# EasyEDA schematic SCH_ChristmasDecoration.json
TITLE: ChristmasBall; REV: 1.1; Date: 2023-12-10; Sheet: 1/1; Drawn By: ArseniiTym; Company: AquaPilot Inc.
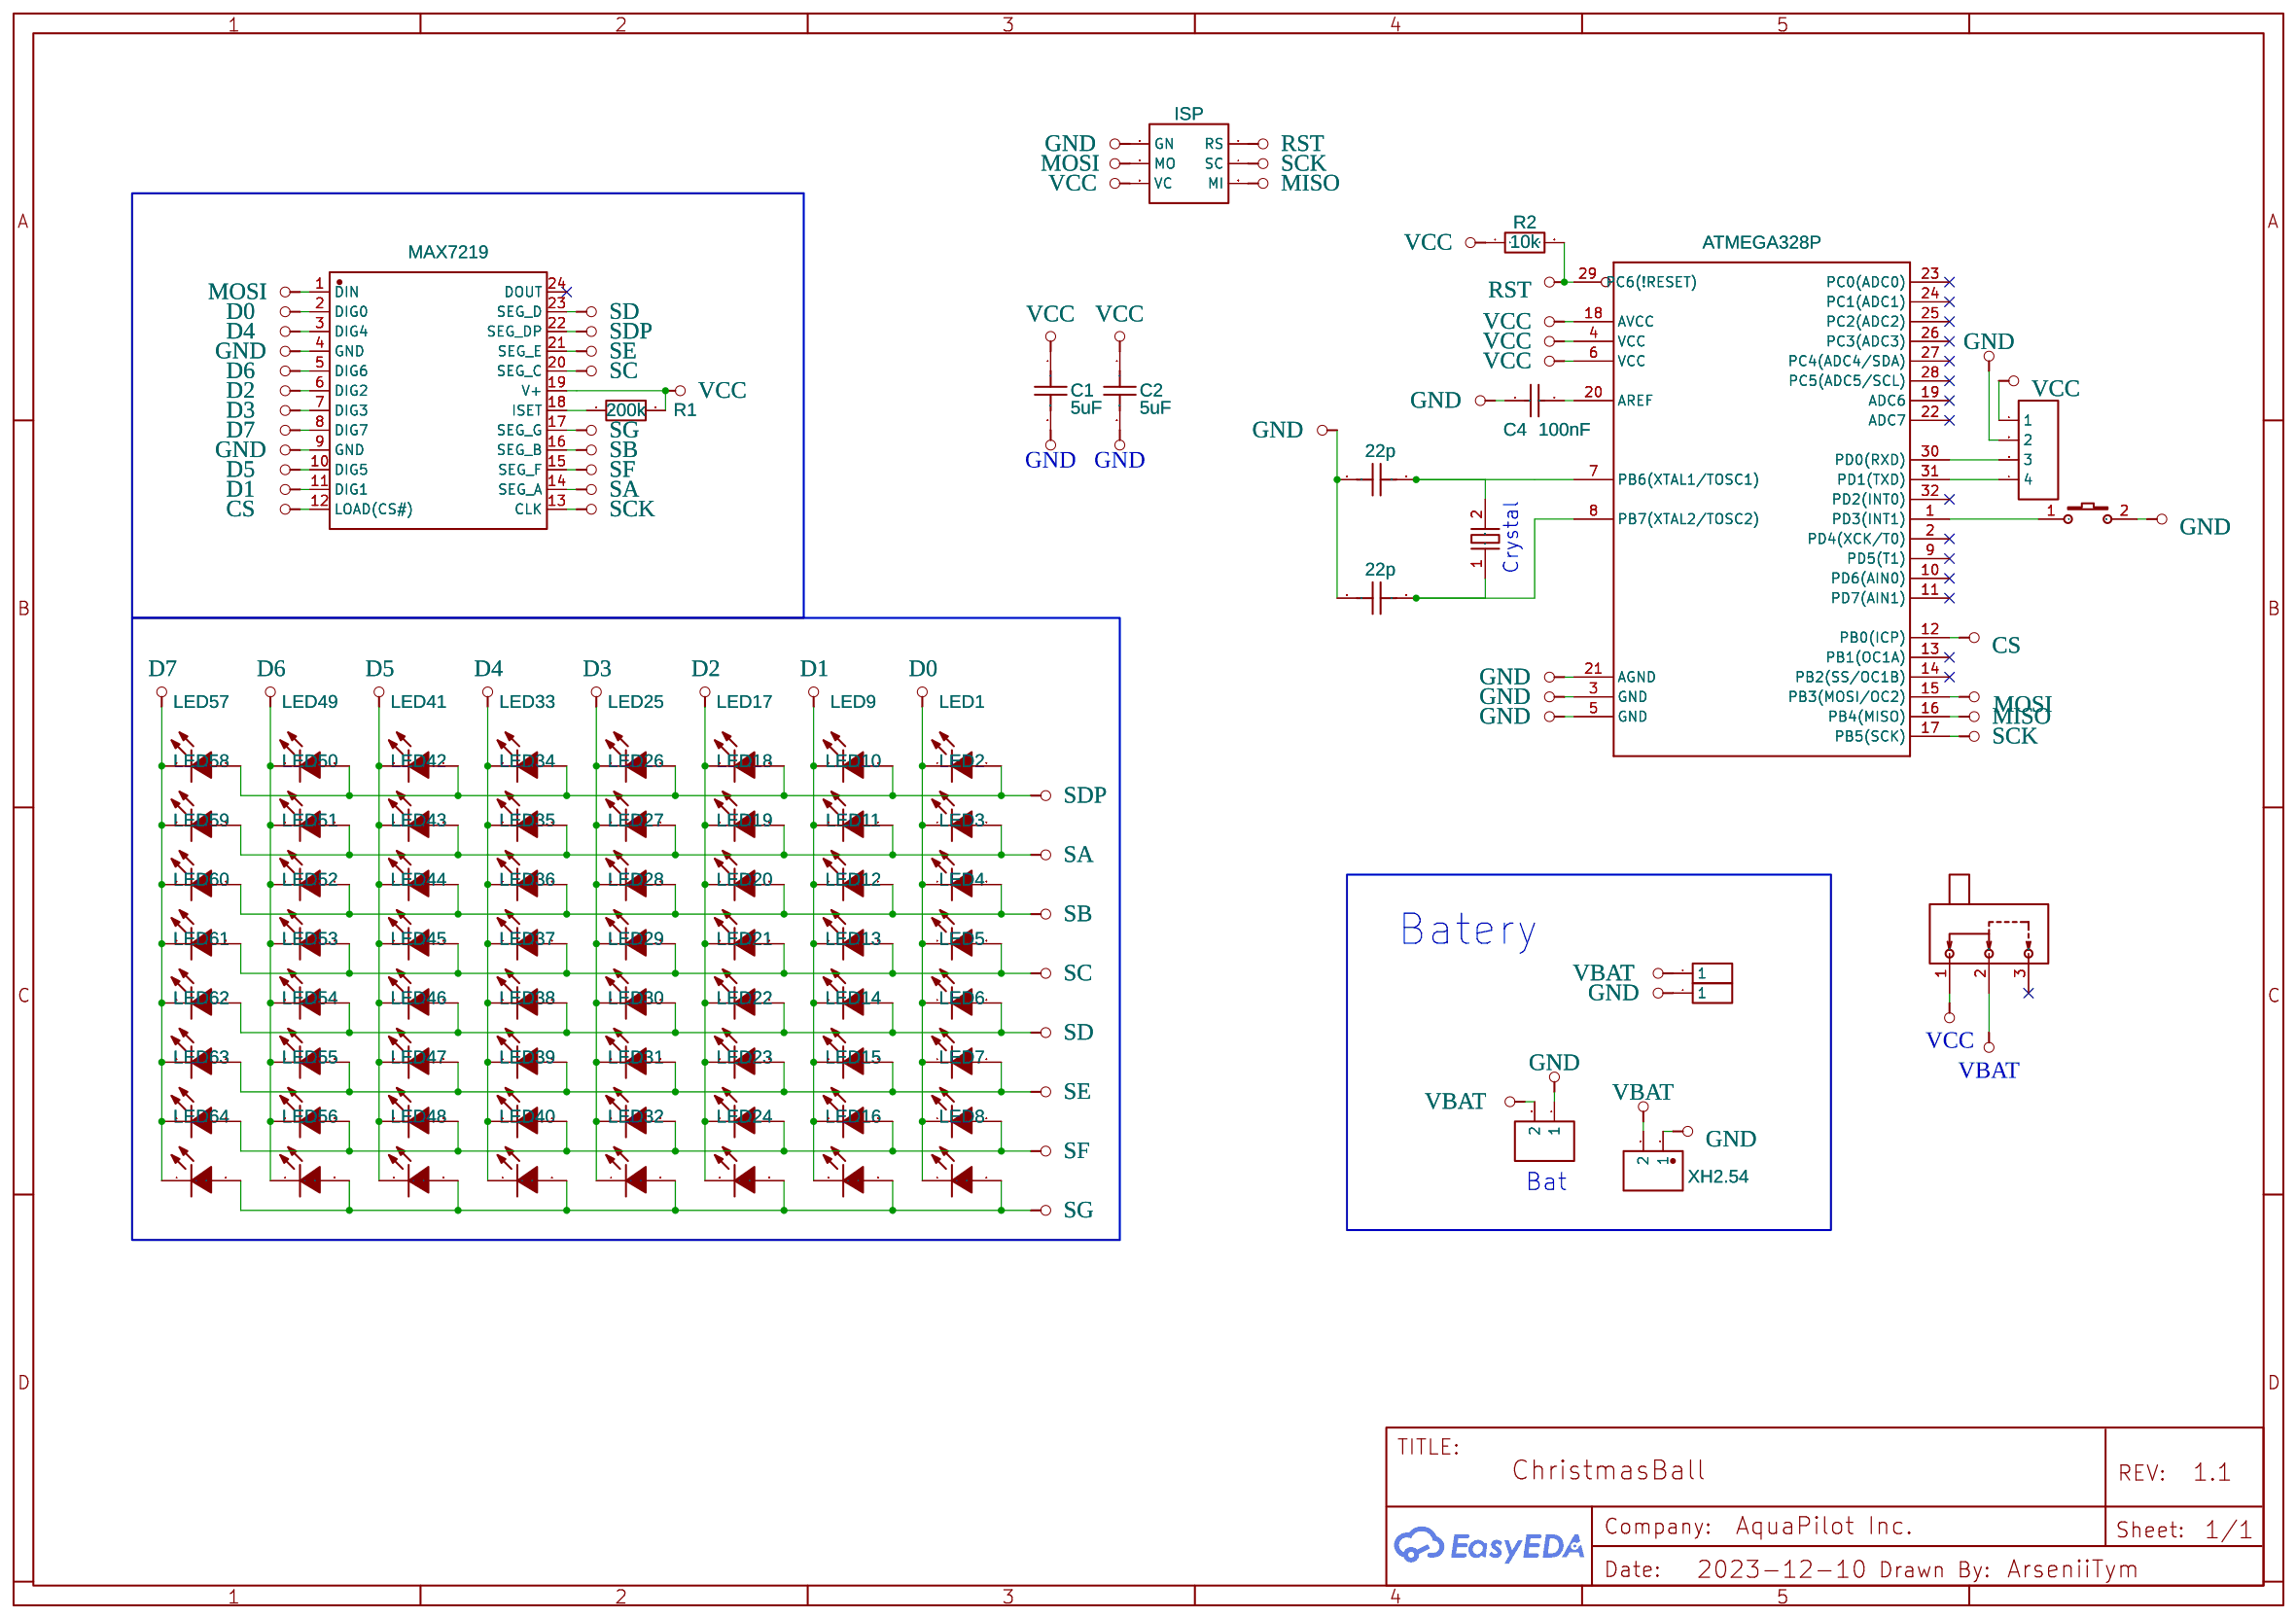
[diagram p0: schematic sheet]

## Parts
C1  5uF  [C1206]
C2  5uF  [C1206]
C3  22p  [C1206]
C4  100nF  [C1206]
C5  22p  [C1206]
CN1  XH2.54  [XH2.54-2P FEMALE CONNECTOR RIGHT ANGLE]
CRYSTAL  -  [HC-49SMD_L11.1-W4.8]
H1  HDR-F-2.54_1x2  [HDR-F-2.54_1X2]
H?#1  HDR-F-2.54_1x4
ICSP  ISP  [HDR-TH_6PIN-V-ROW2-COL3-MALE-PITCH2.54]
J1  HDR-M-2.54_1x1  [HDR-M-2.54_1X1]
J2  HDR-M-2.54_1x1  [HDR-M-2.54_1X1]
LED1  MHT150WDT-C1  [LED1206-RD]
LED2  MHT150WDT-C1  [LED1206-RD]
LED3  MHT150WDT-C1  [LED1206-RD]
LED4  MHT150WDT-C1  [LED1206-RD]
LED5  MHT150WDT-C1  [LED1206-RD]
LED6  MHT150WDT-C1  [LED1206-RD]
LED7  MHT150WDT-C1  [LED1206-RD]
LED8  MHT150WDT-C1  [LED1206-RD]
LED9  MHT150WDT-C1  [LED1206-RD]
LED10  MHT150WDT-C1  [LED1206-RD]
LED11  MHT150WDT-C1  [LED1206-RD]
LED12  MHT150WDT-C1  [LED1206-RD]
LED13  MHT150WDT-C1  [LED1206-RD]
LED14  MHT150WDT-C1  [LED1206-RD]
LED15  MHT150WDT-C1  [LED1206-RD]
LED16  MHT150WDT-C1  [LED1206-RD]
LED17  MHT150WDT-C1  [LED1206-RD]
LED18  MHT150WDT-C1  [LED1206-RD]
LED19  MHT150WDT-C1  [LED1206-RD]
LED20  MHT150WDT-C1  [LED1206-RD]
LED21  MHT150WDT-C1  [LED1206-RD]
LED22  MHT150WDT-C1  [LED1206-RD]
LED23  MHT150WDT-C1  [LED1206-RD]
LED24  MHT150WDT-C1  [LED1206-RD]
LED25  MHT150WDT-C1  [LED1206-RD]
LED26  MHT150WDT-C1  [LED1206-RD]
LED27  MHT150WDT-C1  [LED1206-RD]
LED28  MHT150WDT-C1  [LED1206-RD]
LED29  MHT150WDT-C1  [LED1206-RD]
LED30  MHT150WDT-C1  [LED1206-RD]
LED31  MHT150WDT-C1  [LED1206-RD]
LED32  MHT150WDT-C1  [LED1206-RD]
LED33  MHT150WDT-C1  [LED1206-RD]
LED34  MHT150WDT-C1  [LED1206-RD]
LED35  MHT150WDT-C1  [LED1206-RD]
LED36  MHT150WDT-C1  [LED1206-RD]
LED37  MHT150WDT-C1  [LED1206-RD]
LED38  MHT150WDT-C1  [LED1206-RD]
LED39  MHT150WDT-C1  [LED1206-RD]
LED40  MHT150WDT-C1  [LED1206-RD]
LED41  MHT150WDT-C1  [LED1206-RD]
LED42  MHT150WDT-C1  [LED1206-RD]
LED43  MHT150WDT-C1  [LED1206-RD]
LED44  MHT150WDT-C1  [LED1206-RD]
LED45  MHT150WDT-C1  [LED1206-RD]
LED46  MHT150WDT-C1  [LED1206-RD]
LED47  MHT150WDT-C1  [LED1206-RD]
LED48  MHT150WDT-C1  [LED1206-RD]
LED49  MHT150WDT-C1  [LED1206-RD]
LED50  MHT150WDT-C1  [LED1206-RD]
LED51  MHT150WDT-C1  [LED1206-RD]
LED52  MHT150WDT-C1  [LED1206-RD]
LED53  MHT150WDT-C1  [LED1206-RD]
LED54  MHT150WDT-C1  [LED1206-RD]
LED55  MHT150WDT-C1  [LED1206-RD]
LED56  MHT150WDT-C1  [LED1206-RD]
LED57  MHT150WDT-C1  [LED1206-RD]
LED58  MHT150WDT-C1  [LED1206-RD]
LED59  MHT150WDT-C1  [LED1206-RD]
LED60  MHT150WDT-C1  [LED1206-RD]
LED61  MHT150WDT-C1  [LED1206-RD]
LED62  MHT150WDT-C1  [LED1206-RD]
LED63  MHT150WDT-C1  [LED1206-RD]
LED64  MHT150WDT-C1  [LED1206-RD]
MAX7219  MAX7219CWG  [SOIC-24_L15.4-W7.5-P1.27-LS10.3-BL]
R1  200k  [1206R]
R2  10k  [1206R]
SW1  KEY_OK  [IND-SMD_L6.0-W6.0_SMDRS6028]
SW6  KH-SS12D01-G3-5.0  [SW-TH_KH-SS12D01-G3-5.0]
U11  ATMEGA328P  [TQFP-32]

## Library data of the parts
C1 C2 = C_1206_US: Contributor: LCEDA_Lib
C3 C5 = C_1206_US: Contributor: LCEDA_Lib; Package Display: No
C4 = 0805B104M500: Supplier: LCSC; Manufacturer: WTC; Supplier Part: C94108; Paste Type: expand
CN1 = XH2.54-2P Female Connector Right Angle: Supplier Part: C146113; Manufacturer: Boom Precision Elec; Contributor: Hankwon Chang (InterStellarCloud)
CRYSTAL = CJ03-120001510A20: Contributor: LCSC; Supplier: LCSC; Supplier Part: C712783; Manufacturer: CJ(江苏长电/长晶); JLCPCB Part Class: Extended Part; link: https://lcsc.com/eda_search?q=C712783&%26type=1&ref=editor; Package Display: No
H1 = HDR-F-2.54_1x2: Supplier Part: C49661; Supplier: LCSC; Contributor: LCEDA_Lib; Package Display: No
H?#1 = HDR-F-2.54_1x4: Supplier Part: C225501; Supplier: LCSC
ICSP = -: Supplier: LCSC; Manufacturer: BOOMELE; Manufacturer Part: Header-Male-2.54_2x3; Supplier Part: C65114
J1 J2 = HDR-M-2.54_1x1: Supplier Part: C81276; Supplier: LCSC; Contributor: LCEDA_Lib; Package Display: No
LED1-LED64 = MHT150WDT-C1: Supplier: LCSC; Supplier Part: C412285; Manufacturer: MEIHUA; Contributor: LCSC; SMT Type: Extend; JLCPCB SMD: Yes
MAX7219 = MAX7219CWG: Supplier: LCSC; Manufacturer: MAXIM; image: //image.lceda.cn/szlcsc/C9964.jpg; Supplier Part: C9964; SMT Type: Extend; JLCPCB SMD: Yes
R1 R2 = R_1206_EU: Contributor: LCEDA_Lib
SW1 = K2-3.6×6.1_SMD: Supplier Part: C118141; Supplier: LCSC; Manufacturer Part: K2-1107ST-A4SW-06; Contributor: LCEDA_Lib; 制造商: 韩国韩荣
SW6 = KH-SS12D01-G3-5.0: Contributor: lcsc; Supplier: LCSC; Supplier Part: C5274456; Manufacturer: kinghelm(金航标); JLCPCB Part Class: Extended Part; link: https://lcsc.com/eda_search?q=C5274456&%26type=1&ref=editor; Package Display: No
U11 = -: Contributor: GiaTech_E_Team

## Nets
GND: C1.2 C2.2 C3.1 C4.1 C5.1 CN1.1 H1.1 H?#1.2 ICSP.1(GN) J2.1 MAX7219.4(GND) MAX7219.9(GND) SW1.2 U11.3(GND) U11.5(GND) U11.21(AGND)
VBAT: CN1.2 H1.2 J1.1 SW6.2
VCC: C1.1 C2.1 H?#1.1 ICSP.5(VC) MAX7219.19(V+) R1.2 R2.1 SW6.1 U11.4(VCC) U11.6(VCC) U11.18(AVCC)
CS: MAX7219.12(LOAD(CS#)) U11.12(PB0(ICP))
D0: LED1.1(-) LED2.1(-) LED3.1(-) LED4.1(-) LED5.1(-) LED6.1(-) LED7.1(-) LED8.1(-) MAX7219.2(DIG0)
D1: LED9.1(-) LED10.1(-) LED11.1(-) LED12.1(-) LED13.1(-) LED14.1(-) LED15.1(-) LED16.1(-) MAX7219.11(DIG1)
D2: LED17.1(-) LED18.1(-) LED19.1(-) LED20.1(-) LED21.1(-) LED22.1(-) LED23.1(-) LED24.1(-) MAX7219.6(DIG2)
D3: LED25.1(-) LED26.1(-) LED27.1(-) LED28.1(-) LED29.1(-) LED30.1(-) LED31.1(-) LED32.1(-) MAX7219.7(DIG3)
D4: LED33.1(-) LED34.1(-) LED35.1(-) LED36.1(-) LED37.1(-) LED38.1(-) LED39.1(-) LED40.1(-) MAX7219.3(DIG4)
D5: LED41.1(-) LED42.1(-) LED43.1(-) LED44.1(-) LED45.1(-) LED46.1(-) LED47.1(-) LED48.1(-) MAX7219.10(DIG5)
D6: LED49.1(-) LED50.1(-) LED51.1(-) LED52.1(-) LED53.1(-) LED54.1(-) LED55.1(-) LED56.1(-) MAX7219.5(DIG6)
D7: LED57.1(-) LED58.1(-) LED59.1(-) LED60.1(-) LED61.1(-) LED62.1(-) LED63.1(-) LED64.1(-) MAX7219.8(DIG7)
MISO: ICSP.6(MI) U11.16(PB4(MISO))
MOSI: ICSP.3(MO) MAX7219.1(DIN) U11.15(PB3(MOSI/OC2))
RST: ICSP.2(RS) R2.2 U11.29(PC6(!RESET))
SA: LED2.2(+) LED10.2(+) LED18.2(+) LED26.2(+) LED34.2(+) LED42.2(+) LED50.2(+) LED58.2(+) MAX7219.14(SEG_A)
SB: LED3.2(+) LED11.2(+) LED19.2(+) LED27.2(+) LED35.2(+) LED43.2(+) LED51.2(+) LED59.2(+) MAX7219.16(SEG_B)
SC: LED4.2(+) LED12.2(+) LED20.2(+) LED28.2(+) LED36.2(+) LED44.2(+) LED52.2(+) LED60.2(+) MAX7219.20(SEG_C)
SCK: ICSP.4(SC) MAX7219.13(CLK) U11.17(PB5(SCK))
SD: LED5.2(+) LED13.2(+) LED21.2(+) LED29.2(+) LED37.2(+) LED45.2(+) LED53.2(+) LED61.2(+) MAX7219.23(SEG_D)
SDP: LED1.2(+) LED9.2(+) LED17.2(+) LED25.2(+) LED33.2(+) LED41.2(+) LED49.2(+) LED57.2(+) MAX7219.22(SEG_DP)
SE: LED6.2(+) LED14.2(+) LED22.2(+) LED30.2(+) LED38.2(+) LED46.2(+) LED54.2(+) LED62.2(+) MAX7219.21(SEG_E)
SF: LED7.2(+) LED15.2(+) LED23.2(+) LED31.2(+) LED39.2(+) LED47.2(+) LED55.2(+) LED63.2(+) MAX7219.15(SEG_F)
SG: LED8.2(+) LED16.2(+) LED24.2(+) LED32.2(+) LED40.2(+) LED48.2(+) LED56.2(+) LED64.2(+) MAX7219.17(SEG_G)
Net-(CRYSTAL-GND): C3.2 CRYSTAL.2(GND) U11.7(PB6(XTAL1/TOSC1))
Net-(MAX7219-ISET): MAX7219.18(ISET) R1.1
Net-(U11-AREF): C4.2 U11.20(AREF)
Net-(U11-PB7(XTAL2/TOSC2)): C5.2 CRYSTAL.1 U11.8(PB7(XTAL2/TOSC2))
Net-(U11-PD0(RXD)): H?#1.3 U11.30(PD0(RXD))
Net-(U11-PD1(TXD)): H?#1.4 U11.31(PD1(TXD))
Net-(U11-PD3(INT1)): SW1.1 U11.1(PD3(INT1))

Not connected (* = marked no-connect by the designer): MAX7219 24(DOUT)*; SW6 3*; U11 2(PD4(XCK/T0))* 9(PD5(T1))* 10(PD6(AIN0))* 11(PD7(AIN1))* 13(PB1(OC1A))* 14(PB2(SS/OC1B))* 19(ADC6)* 22(ADC7)* 23(PC0(ADC0))* 24(PC1(ADC1))* 25(PC2(ADC2))* 26(PC3(ADC3))* 27(PC4(ADC4/SDA))* 28(PC5(ADC5/SCL))* 32(PD2(INT0))*

## Notes on the sheet
- Crystal
- Batery
- Bat
